# Altium schematic sheet drvamap.SchDoc: JKA 2.0 原理图
size A4; Author: JACK; CompanyName: 北京康洁之晨水处理技术有限公司; DrawnBy: 郭相炳; Organization: 北京康洁; DocumentNumber: 6; Revision: 2.0; SheetNumber: 6; SheetTotal: 6; ImagePath: E:\JKAdoc\data\LOGO.jpg; ProjectName: JKA2.0
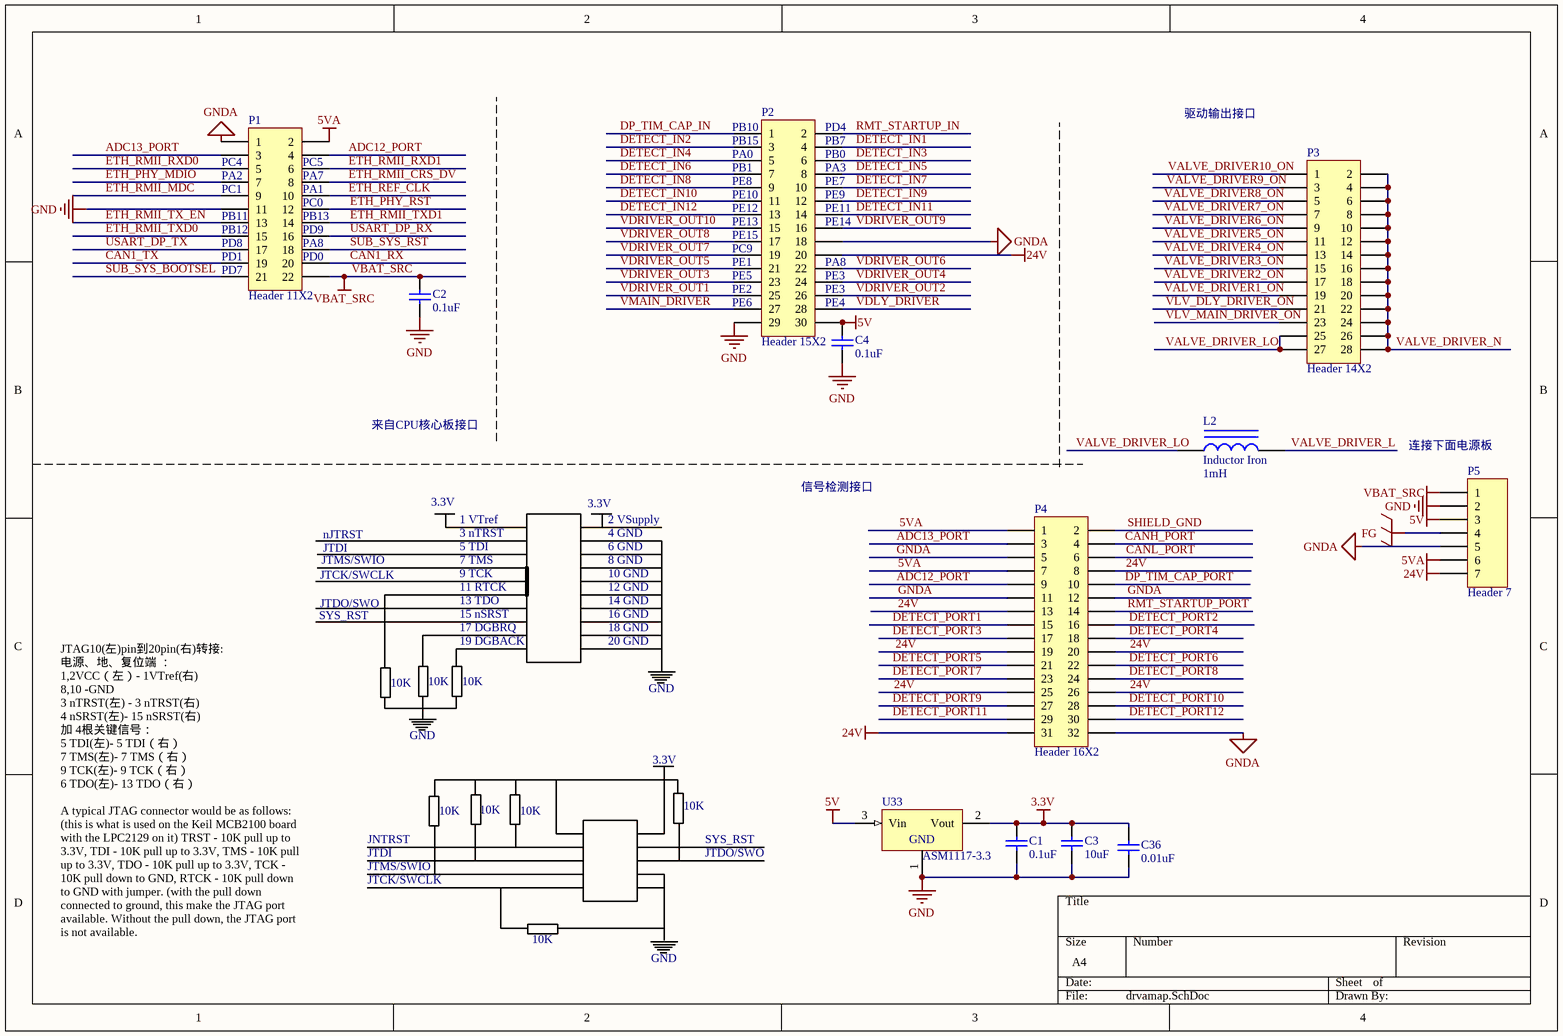
[diagram p0: drvamap.SchDoc]

## Parts
C1  0.1uF  [CAPC2012M]
C2  0.1uF  [CAPC2012M]
C3  10uF  [CAPC2012M]
C4  0.1uF  [CAPC2012M]
C36  0.01uF  [CAPC2012M]
L2  Inductor Iron  value 1mH  [CAPPR5-8x8A]
P1  Header 11X2  [HDR2X11]
P2  Header 15X2  [HDR2X15]
P3  Header 14X2  [DG127A-3.81-14]
P4  Header 16X2  [DG127A-3.81-16]
P5  Header 7  [HDR1X7]
U33  ASM1117-3.3  [SOT-223]

## Nets
3.3V: C1.2 C3.2 C36.2 U33.2(Vout)
5V: C4.1 P2.30 P5.3 U33.3(Vin)
5VA: P1.2 P4.1 P4.7 P5.6
24V: P2.20 P4.8 P4.13 P4.19 P4.20 P4.25 P4.26 P4.31 P5.7
FG: P5.4
GND: C1.1 C2.2 C3.1 C4.2 C36.1 P1.11 P2.29 P5.2 U33.1(GND)
GNDA: P1.1 P2.18 P4.5 P4.11 P4.12 P4.32 P5.5
VBAT_SRC: C2.1 P1.22 P5.1
ADC12_PORT: P1.4 P4.9
ADC13_PORT: P1.3 P4.3
CAN1_RX: P1.20
CAN1_TX: P1.19
CANH_PORT: P4.4
CANL_PORT: P4.6
DETECT_IN1: P2.4
DETECT_IN2: P2.3
DETECT_IN3: P2.6
DETECT_IN4: P2.5
DETECT_IN5: P2.8
DETECT_IN6: P2.7
DETECT_IN7: P2.10
DETECT_IN8: P2.9
DETECT_IN9: P2.12
DETECT_IN10: P2.11
DETECT_IN11: P2.14
DETECT_IN12: P2.13
DETECT_PORT1: P4.15
DETECT_PORT2: P4.16
DETECT_PORT3: P4.17
DETECT_PORT4: P4.18
DETECT_PORT5: P4.21
DETECT_PORT6: P4.22
DETECT_PORT7: P4.23
DETECT_PORT8: P4.24
DETECT_PORT9: P4.27
DETECT_PORT10: P4.28
DETECT_PORT11: P4.29
DETECT_PORT12: P4.30
DP_TIM_CAP_IN: P2.1
DP_TIM_CAP_PORT: P4.10
ETH_PHY_MDIO: P1.7
ETH_PHY_RST: P1.12
ETH_REF_CLK: P1.10
ETH_RMII_CRS_DV: P1.8
ETH_RMII_MDC: P1.9
ETH_RMII_RXD0: P1.5
ETH_RMII_RXD1: P1.6
ETH_RMII_TX_EN: P1.13
ETH_RMII_TXD0: P1.15
ETH_RMII_TXD1: P1.14
RMT_STARTUP_IN: P2.2
RMT_STARTUP_PORT: P4.14
SHIELD_GND: P4.2
SUB_SYS_BOOTSEL: P1.21
SUB_SYS_RST: P1.18
USART_DP_RX: P1.16
USART_DP_TX: P1.17
VALVE_DRIVER1_ON: P3.19
VALVE_DRIVER2_ON: P3.17
VALVE_DRIVER3_ON: P3.15
VALVE_DRIVER4_ON: P3.13
VALVE_DRIVER5_ON: P3.11
VALVE_DRIVER6_ON: P3.9
VALVE_DRIVER7_ON: P3.7
VALVE_DRIVER8_ON: P3.5
VALVE_DRIVER9_ON: P3.3
VALVE_DRIVER10_ON: P3.1
VALVE_DRIVER_L: L2.2
VALVE_DRIVER_LO: L2.1 P3.25 P3.27
VALVE_DRIVER_N: P3.2 P3.4 P3.6 P3.8 P3.10 P3.12 P3.14 P3.16 P3.18 P3.20 P3.22 P3.24 P3.26 P3.28
VDLY_DRIVER: P2.28
VDRIVER_OUT1: P2.25
VDRIVER_OUT2: P2.26
VDRIVER_OUT3: P2.23
VDRIVER_OUT4: P2.24
VDRIVER_OUT5: P2.21
VDRIVER_OUT6: P2.22
VDRIVER_OUT7: P2.19
VDRIVER_OUT8: P2.17
VDRIVER_OUT9: P2.16
VDRIVER_OUT10: P2.15
VLV_DLY_DRIVER_ON: P3.21
VLV_MAIN_DRIVER_ON: P3.23
VMAIN_DRIVER: P2.27

## Notes on the sheet
- (near P1) PA2
- (near P1) PC4
- (near P1) PA7
- (near P1) PC5
- (near P2) PB10
- (near P2) PB1
- (near P2) PA0
- (near P2) PB15
- (near P2) PB7
- (near P2) PD4
- (near P2) PA3
- (near P2) PB0
- 驱动输出接口
- (near P1) PB11
- (near P1) PB12
- (near P1) PC1
- (near P1) PD8
- (near P1) PA1
- (near P1) PA8
- (near P1) PB13
- (near P1) PC0
- (near P1) PD9
- (near P2) PE15
- (near P2) PE12
- (near P2) PE13
- (near P2) PE10
- (near P2) PE8
- (near P2) PE14
- (near P2) PE11
- (near P2) PE9
- (near P2) PE7
- (near P1) PD1
- (near P1) PD7
- (near P1) PD0
- (near P2) PE6
- (near P2) PE2
- (near P2) PE5
- (near P2) PE1
- (near P2) PC9
- (near P2) PE4
- (near P2) PE3
- (near P2) PA8
- 来自CPU核心板接口
- (near P5) 连接下面电源板
- 3.3V
- 信号检测接口
- JTCK/SWCLK
- JTMS/SWIO
- nJTRST
- JTDI
- 1 VTref
- 3 nTRST
- 5 TDI
- 7 TMS
- 9 TCK
- 2 VSupply
- 4 GND
- 6 GND
- 8 GND
- 10 GND
- SYS_RST
- JTDO/SWO
- 11 RTCK
- 13 TDO
- 15 nSRST
- 17 DGBRQ
- 19 DGBACK
- 12 GND
- 14 GND
- 16 GND
- 18 GND
- 20 GND
- 10K
- GND
- JTAG10(左)pin到20pin(右)转接:
  电源、地、复位端 ：
  1,2VCC（左）- 1VTref(右)
  8,10 -GND
  3 nTRST(左) - 3 nTRST(右)
  4 nSRST(左)- 15 nSRST(右)
  加 4根关键信号：
  5 TDI(左)- 5 TDI（右）
  7 TMS(左)- 7 TMS（右）
  9 TCK(左)- 9 TCK（右）
  6 TDO(左)- 13 TDO（右）
- JNTRST
- A typical JTAG connector would be as follows: (this is what is used on the Keil MCB2100 board with the LPC2129 on it) TRST - 10K pull up to 3.3V, TDI - 10K pull up to 3.3V, TMS - 10K pull up to 3.3V, TDO - 10K pull up to 3.3V, TCK - 10K pull down to GND, RTCK - 10K pull down to GND with jumper. (with the pull down connected to ground, this make the JTAG port available. Without the pull down, the JTAG port is not available.

## Library data of the parts
C1-C4 C36 = Cap: Capacitor; Value: 1nF; Published: 8-Jun-2000; LatestRevisionDate: 17-Jul-2002; LatestRevisionNote: Re-released for DXP Platform.; PackageReference: RAD-0.3; Publisher: Altium Limited
L2 = Inductor Iron: Magnetic-Core Inductor; Published: 24-Mar-1999; LatestRevisionDate: 17-Jul-2002; LatestRevisionNote: Re-released for DXP Platform.; PackageReference: AXIAL-0.9; Publisher: Altium Limited; PackageDescription: Axial Device, Thru-Hole; 2 Leads; 0.9 in Pin Spacing
P1 = Header 11X2: Header, 11-Pin, Dual row; LatestRevisionDate: 17-Jul-2002; LatestRevisionNote: Re-released for DXP Platform.; Publisher: Altium Limited
P2 = Header 15X2: Header, 15-Pin, Dual row; LatestRevisionDate: 17-Jul-2002; LatestRevisionNote: Re-released for DXP Platform.; Publisher: Altium Limited
P3 = Header 14X2: Header, 14-Pin, Dual row; LatestRevisionDate: 17-Jul-2002; LatestRevisionNote: Re-released for DXP Platform.; Publisher: Altium Limited
P4 = Header 16X2: Header, 16-Pin, Dual row; LatestRevisionDate: 17-Jul-2002; LatestRevisionNote: Re-released for DXP Platform.; Publisher: Altium Limited
P5 = Header 7: Header, 7-Pin; LatestRevisionDate: 17-Jul-2002; LatestRevisionNote: Re-released for DXP Platform.; Publisher: Altium Limited
U33 = LM1117T-5.0: 800mA Low-Dropout Linear Regulator